# EAGLE design hidrosonico_v0-4 (EAGLE 7.3.0)
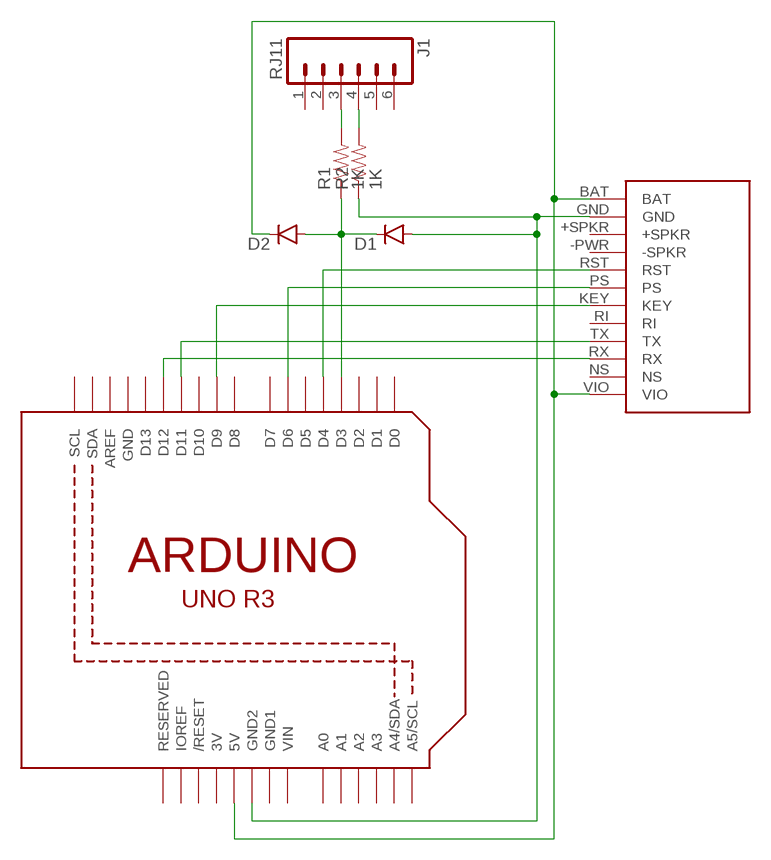
[diagram p0: schematic, sheet 1]

## Parts
D1  DIODE1N4148  [DIODE-1N4148]
D2  DIODE1N4148  [DIODE-1N4148]
J1  RJ11  RJ11-6PTH  [RJ11-6]
R1  1K  RESISTORPTH-1/2W  [AXIAL-0.5]
R2  1K  RESISTORPTH-1/2W  [AXIAL-0.5]
U2  ARDUINOR3-DIMENSION  [ARDUINOR3]
U$1  ADAFRUIT_FONA800  [FONA]

## Nets
GND [supply]: D1.A R2.P$1 U2.GND2 U$1.GND
N$1: U2.D4 U$1.RST
N$2: U2.D6 U$1.PS
N$3: U2.D9 U$1.KEY
N$4: U2.D11 U$1.TX
N$5: U2.D12 U$1.RX
N$8: J1.3 R1.P$2
N$9: D1.C D2.A R1.P$1 U2.D3
N$10: J1.4 R2.P$2
VCC+ [supply]: D2.C U2.5V U$1.BAT U$1.VIO
Unconnected: J1.1 J1.2 J1.5 J1.6 U2.A0 U2.A1 U2.A2 U2.A3 U2.A4(A4/SDA) U2.A5(A5/SCL) U2.AREF U2.D0 U2.D1 U2.D2 U2.D5 U2.D7 U2.D8 U2.D10 U2.D13 U2.IOREF U2.RESERVED U2.RESET(/RESET) U2.SCL U2.SDA U$1.+SPKR U$1.-PWR(-SPKR) U$1.NS U$1.RI

## Power pins joined to a net without a drawn wire
3V: U2.3V
GND: U2.GND
GND1: U2.GND1
VIN: U2.VIN

## Library data of the parts
D1 D2 = SparkFun-DiscreteSemi:DIODE: Diode These are standard reverse protection diodes and small signal diodes. SMA package can handle up to about 1A. SOD-323 can handle about 200mA. What the SOD-323 package when ordering, there are some mfgs out there that are 5-pin packages.
J1 = SparkFun-Connectors:RJ11-6: RJ11 Jack Simple 6 pin RJ11 jack. Commonly found on CAT3 devices and Microchip programmers. SKU: PRT-00132; PROD_ID: CONN-08590
R1 R2 = SparkFun-Passives:RESISTOR: Resistor Basic schematic elements and footprints for 0603, 1206, and PTH resistors.
U2 = dai-maker-lab:ARDUINOR3: This is a new object for the new Arduino R3 - with extra pins that you may want to use (such as IOref, and duplicated A4/A5
U$1 = dai-maker-lab:ADAFRUIT_FONA800

## Net classes
0 default: width 0.254 mm, clearance 0.254 mm
1 supply: width 0.508 mm, clearance 0.508 mm

## Board
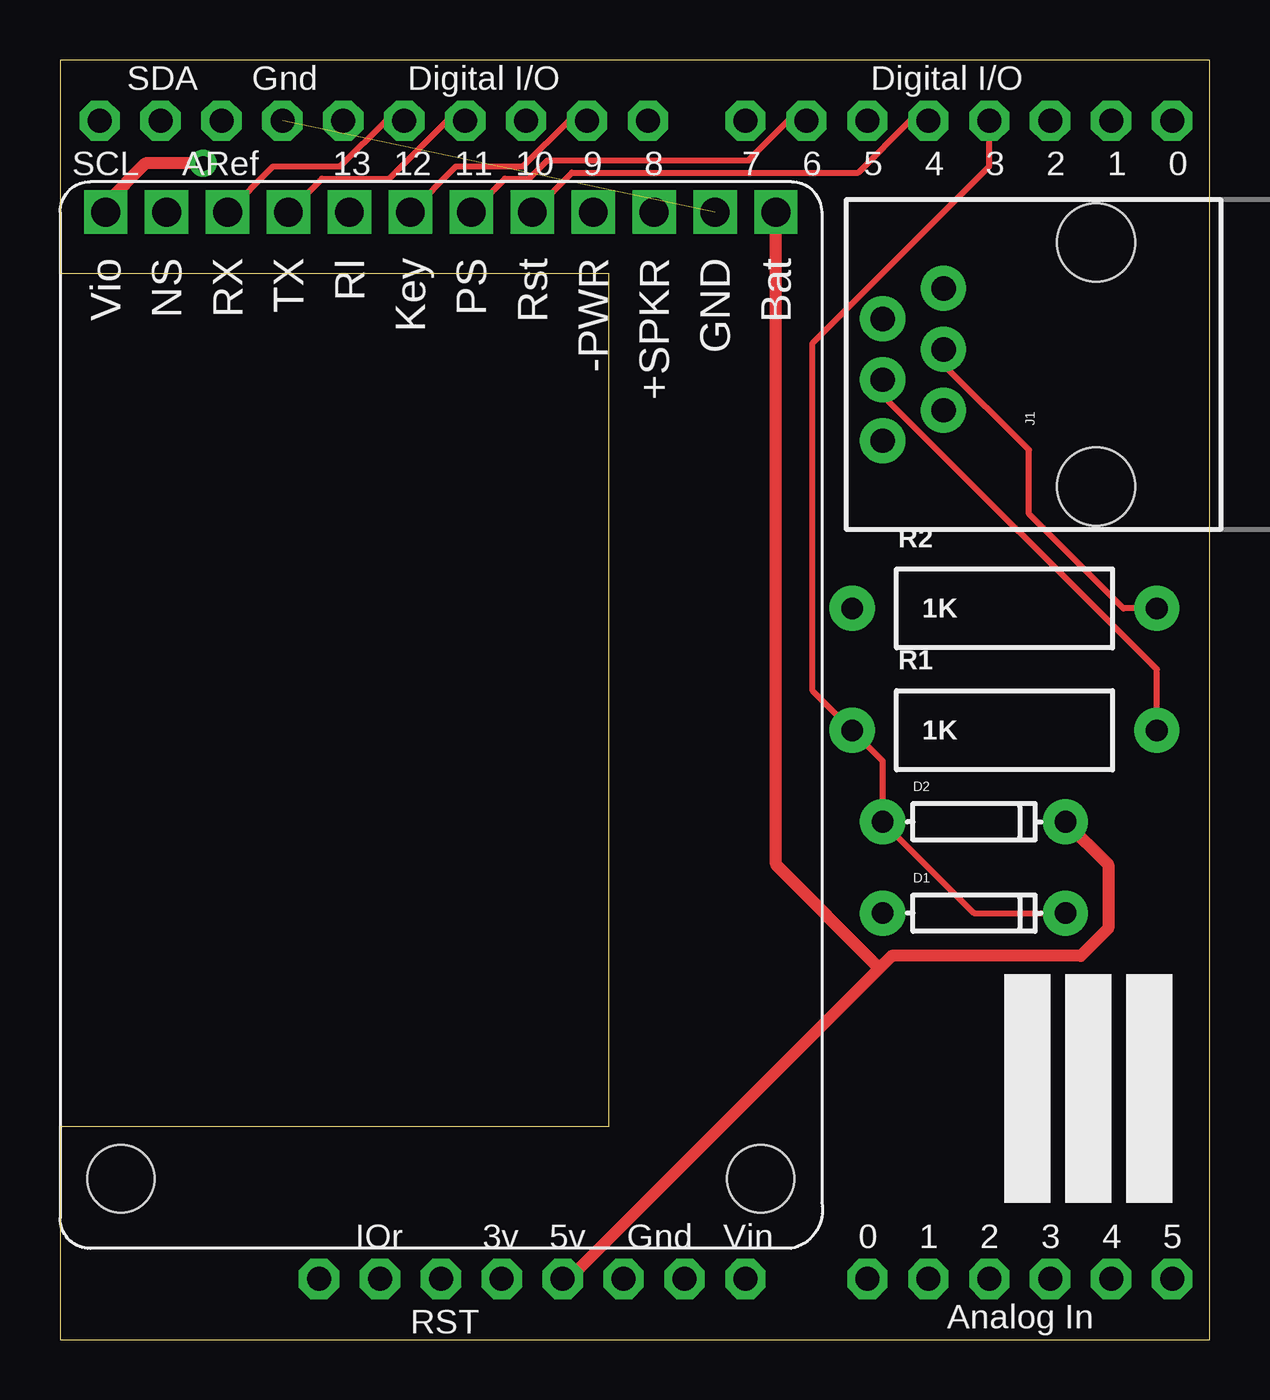
[diagram p1: board, top side]
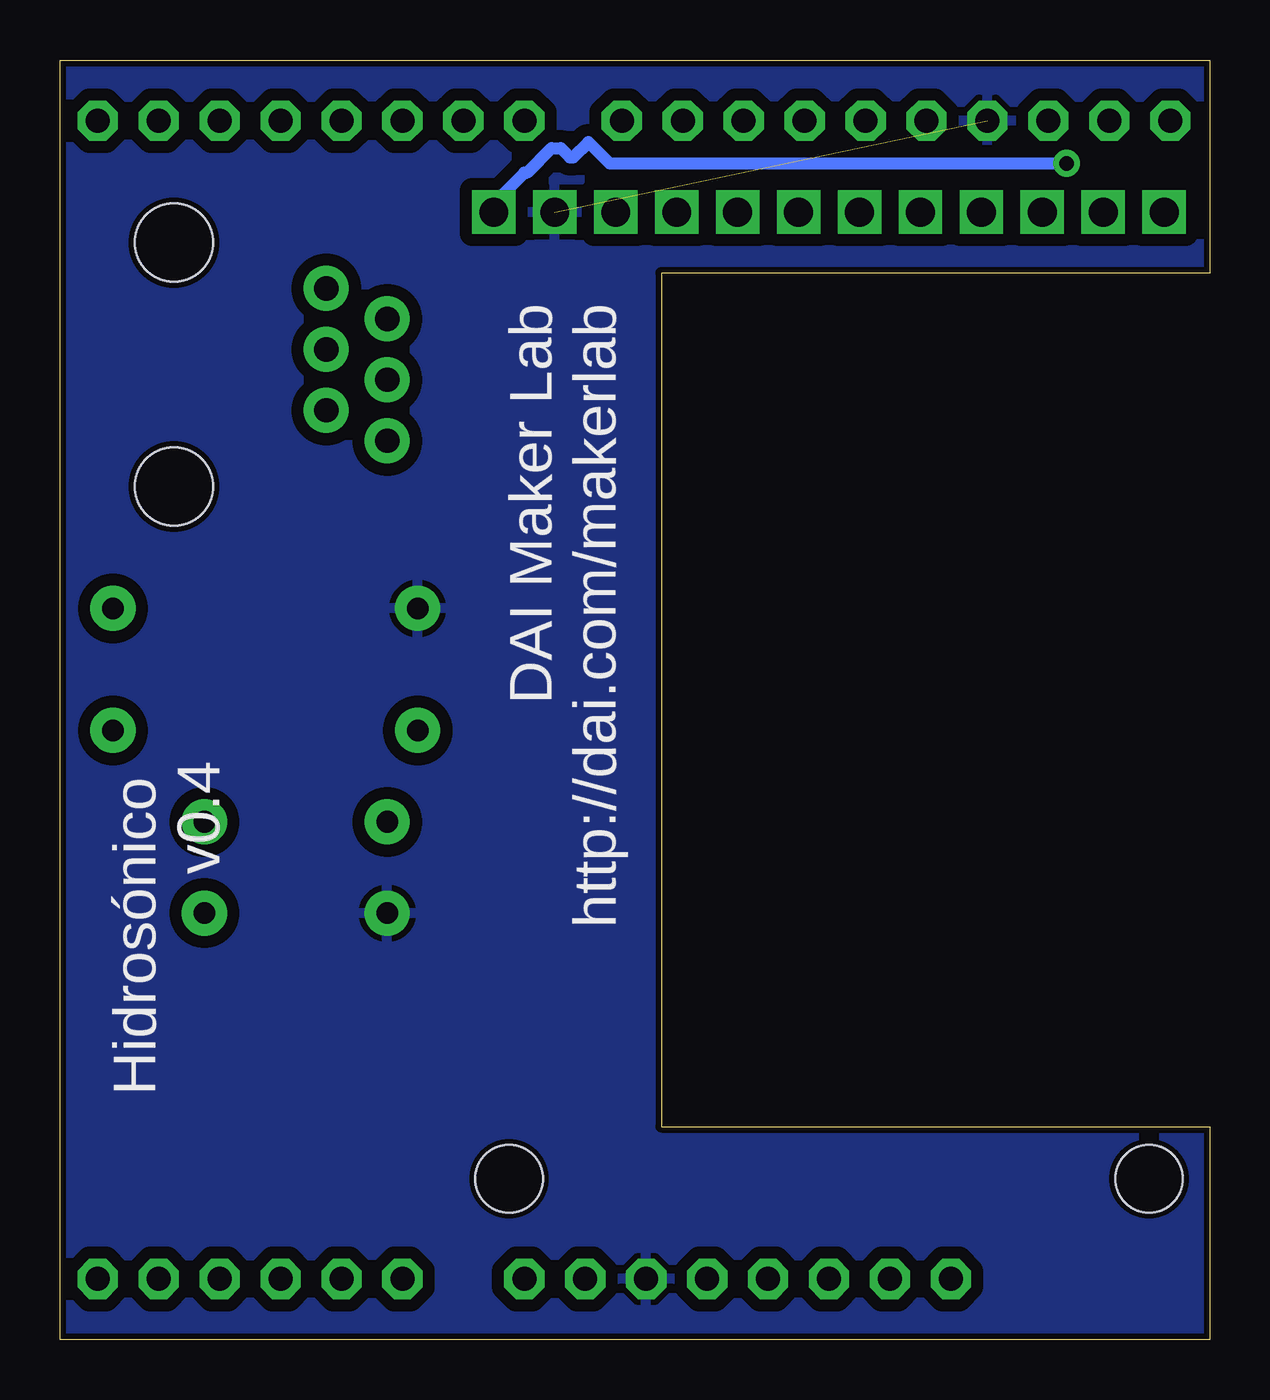
[diagram p2: board, bottom side, seen from below]

Size 47.93 x 53.33 mm. Coordinates in mm from the lower left corner, seen from the top.
Outline: 0,0 47.93,0 47.93,53.33 0,53.33 0,44.45 22.86,44.45 22.86,8.89 0,8.89 0,0
Copper layers (1*16): Top 0.035mm / dielectric 1.5mm / Bottom 0.035mm
Design rules "SparkFun": minimum track width 8mil, minimum drill 20mil, track to track 8mil, track to pad 8mil, pad to pad 8mil, via to via 8mil, smd to smd 8mil, copper to edge 10mil, drill to drill 8mil, minimum pad ring 12mil, minimum via ring 10mil, stop-mask expansion 4mil, vias tented up to drill 25mil, thermal gap 10mil

### Footprints (pad centres in the part's own frame; a part is rotated, then mirrored left to right if it is on the bottom)
DIODE-1N4148 = drill 0.9 pad 1.88: A -3.81,0; C 3.81,0
RJ11-6 = drill 1.016 pad 1.88: 1 -3.175,8.89; 2 -1.905,6.35; 3 -0.635,8.89; 4 0.635,6.35; 5 1.905,8.89; 6 3.175,6.35 | hole 3.251: -5.08,0; 5.08,0
AXIAL-0.5 = drill 0.9 pad 1.88: P$1 -6.35,0; P$2 6.35,0
ARDUINOR3 = drill 1 pad 1.676 octagon: 3V 35.56,2.54; 5V 38.1,2.54; A0 50.8,2.54; A1 53.34,2.54; A2 55.88,2.54; A3 58.42,2.54; A4 60.96,2.54; A5 63.5,2.54; AREF 23.876,50.8; D0 63.5,50.8; D1 60.96,50.8; D2 58.42,50.8; D3 55.88,50.8; D4 53.34,50.8; D5 50.8,50.8; D6 48.26,50.8; D7 45.72,50.8; D8 41.656,50.8; D9 39.116,50.8; D10 36.576,50.8; D11 34.036,50.8; D12 31.496,50.8; D13 28.956,50.8; GND 26.416,50.8; GND1 43.18,2.54; GND2 40.64,2.54; IOREF 30.48,2.54; RESERVED 27.94,2.54; RESET 33.02,2.54; SCL 18.796,50.8; SDA 21.336,50.8; VIN 45.72,2.54
FONA = drill 1.2 square: +SPKR 6.985,1.27; -PWR 9.525,1.27; BAT 1.905,1.27; GND 4.445,1.27; KEY 17.145,1.27; NS 27.305,1.27; PS 14.605,1.27; RI 19.685,1.27; RST 12.065,1.27; RX 24.765,1.27; TX 22.225,1.27; VIO 29.845,1.27 | hole 2.8: 2.54,41.545; 29.21,41.545

### Placement (x,y rotation side)
D1  38.1,17.78 0 top
D2  38.1,21.59 0 top
J1  43.18,40.64 90 top
R1  39.37,25.4 0 top
R2  39.37,30.48 0 top
U2  -17.14,0 0 top
U$1  31.75,48.26 180 top

### Tracks (layer width: path | path; a pad name or v marks a point on that pad's centre or on a via)
GND  (1 unrouted)
  pour Bottom: 0,53.34 0,44.45 22.86,44.45 22.86,8.89 0,8.89 0,0 48.26,0 48.26,53.34 1.27,53.34
N$1
  Top 0.254: U2.D4 35.43,50.8 33.27,48.64 21.34,48.64 U$1.RST
N$2
  Top 0.254: U2.D6 30.35,50.8 28.7,49.15 20.32,49.15 19.56,48.39 18.54,48.39 U$1.PS
N$3
  Top 0.254: U2.D9 21.21,50.8 19.3,48.9 16.51,48.9 U$1.KEY
N$4
  Top 0.254: U2.D11 16.13,50.8 13.72,48.39 10.92,48.39 U$1.TX
N$5
  Top 0.254: U2.D12 13.59,50.8 11.68,48.9 8.89,48.9 U$1.RX
N$8
  Top 0.254: J1.3 34.29,39.37 45.72,27.94 R1.P$2
N$9
  Top 0.254: U2.D3 38.73,48.9 31.37,41.53 31.37,27.05 R1.P$1 34.29,24.13 D2.A 38.1,17.78 D1.C
N$10
  Top 0.254: J1.4 36.83,40.64 40.39,37.08 40.39,34.42 44.32,30.48 R2.P$2
VCC+  (via drill 0.61)
  Top 0.508: U$1.VIO 1.9,47.37 3.56,49.02 v5.97,49.02 | U2.5V 21.21,2.54 34.16,15.49 | 34.16,15.49 34.67,16 42.55,16 43.69,17.14 43.69,19.81 D2.C | U$1.BAT 29.84,19.81 34.16,15.49
  Bottom 0.508: v5.97,49.02 25.02,49.02 25.91,49.91 26.54,49.28 26.67,49.28 27.05,49.66 27.43,49.66 28.45,48.64 28.57,48.64 29.84,47.37 U$1.BAT

### Text on the board
bPlace: DAI Maker Lab / http://dai.com/makerlab | Hidrosónico / v0.4